# EAGLE schematic Pro Trinket Keyboard (EAGLE 7.1.0)
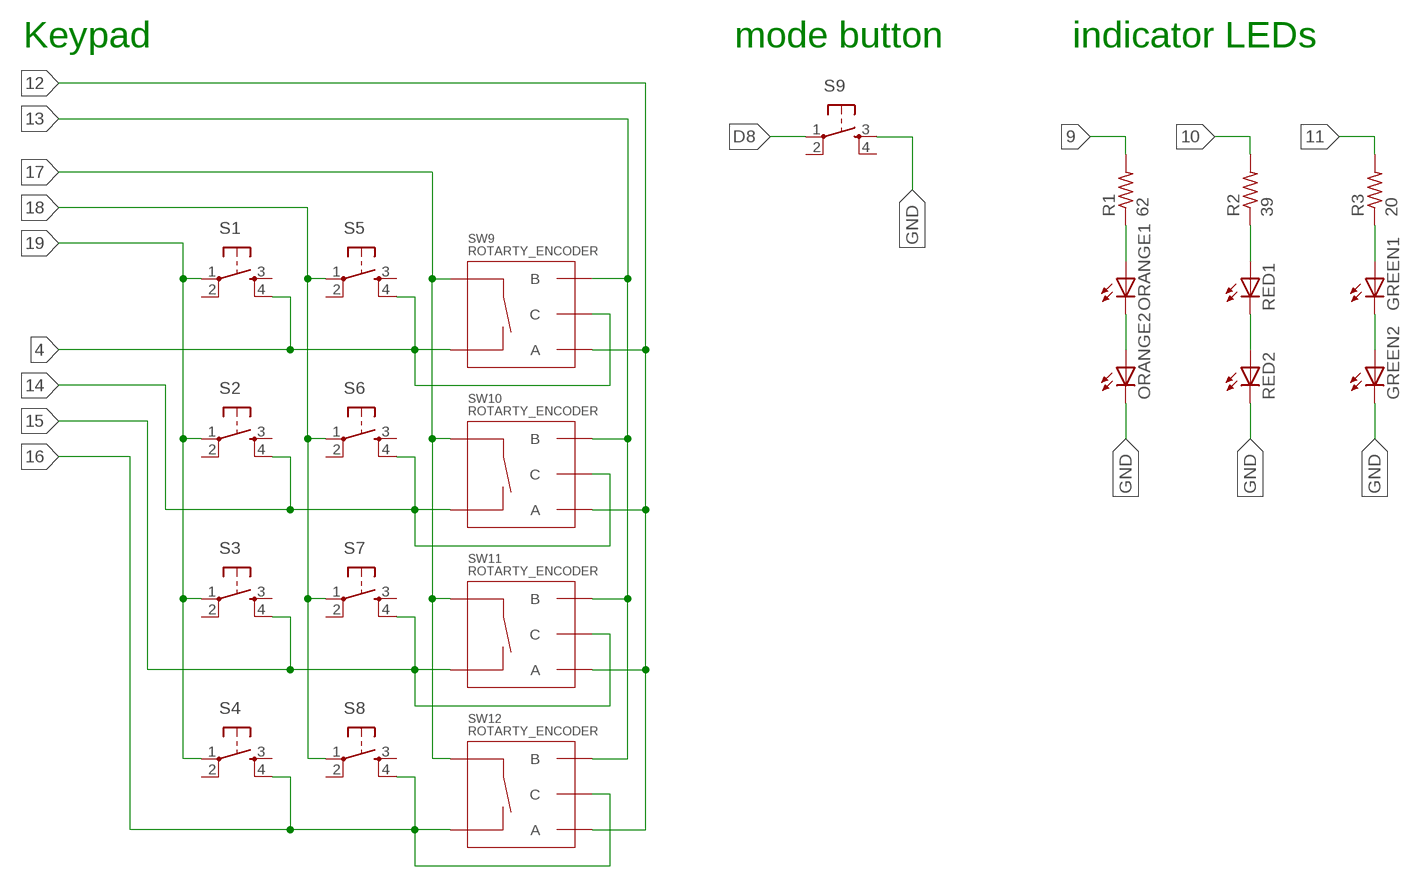
[diagram p0: schematic, sheet 1]

## Parts
GREEN1  LED3MM  [LED3MM]
GREEN2  LED3MM  [LED3MM]
ORANGE1  LED3MM  [LED3MM]
ORANGE2  LED3MM  [LED3MM]
R1  62  R-US_0204/7  [0204/7]
R2  39  R-US_0204/7  [0204/7]
R3  20  R-US_0204/7  [0204/7]
RED1  LED3MM  [LED3MM]
RED2  LED3MM  [LED3MM]
S1  TAC_SWITCHPTH  [TACTILE-PTH]
S2  TAC_SWITCHPTH  [TACTILE-PTH]
S3  TAC_SWITCHPTH  [TACTILE-PTH]
S4  TAC_SWITCHPTH  [TACTILE-PTH]
S5  TAC_SWITCHPTH  [TACTILE-PTH]
S6  TAC_SWITCHPTH  [TACTILE-PTH]
S7  TAC_SWITCHPTH  [TACTILE-PTH]
S8  TAC_SWITCHPTH  [TACTILE-PTH]
S9  TAC_SWITCHPTH  [TACTILE-PTH]
SW9  ROTARTY_ENCODER  [ROTARY_ENC_PLAIN]
SW10  ROTARTY_ENCODER  [ROTARY_ENC_PLAIN]
SW11  ROTARTY_ENCODER  [ROTARY_ENC_PLAIN]
SW12  ROTARTY_ENCODER  [ROTARY_ENC_PLAIN]

## Nets
4: S1.4 S5.4 SW9.C SW9.SW-
9: R1.2
10: R2.2
11: R3.2
12: SW9.A SW10.A SW11.A SW12.A
13: SW9.B SW10.B SW11.B SW12.B
14: S2.4 S6.4 SW10.C SW10.SW-
15: S3.4 S7.4 SW11.C SW11.SW-
16: S4.4 S8.4 SW12.C SW12.SW-
17: SW9.SW+ SW10.SW+ SW11.SW+ SW12.SW+
18: S5.1 S6.1 S7.1 S8.1
19: S1.1 S2.1 S3.1 S4.1
D8: S9.1
GND: GREEN2.K(C) ORANGE2.K(C) RED2.K(C) S9.3
N$1: ORANGE1.A R1.1
N$2: ORANGE1.K(C) ORANGE2.A
N$3: R2.1 RED1.A
N$4: RED1.K(C) RED2.A
N$5: GREEN1.A R3.1
N$6: GREEN1.K(C) GREEN2.A
Unconnected: S1.2 S1.3 S2.2 S2.3 S3.2 S3.3 S4.2 S4.3 S5.2 S5.3 S6.2 S6.3 S7.2 S7.3 S8.2 S8.3 S9.2 S9.4

## Notes on the sheet
- Keypad | mode button | indicator LEDs

## Library data of the parts
GREEN1 GREEN2 ORANGE1 ORANGE2 RED1 RED2 = adafruit:LED: LED OSRAM: - CHIPLED LG R971, LG N971, LY N971, LG Q971, LY Q971, LO R971, LY R971 LH N974, LH R974 LS Q976, LO Q976, LY Q976 LO Q996 - Hyper CHIPLED LW Q18S LB Q993, LB Q99A, LB R99A - SideLED LS A670, LO A670, LY A670, LG A670, LP A670 LB A673, LV A673, LT A673, LW A673 LH A674 LY A675 LS A676, LA A676, LO A676, LY A676, LW A676 LS A679, LY A679, LG A679 - Hyper Micro SIDELED® LS Y876, LA Y876, LO Y876, LY Y876 LT Y87S - SmartLED LW L88C, LW L88S LB L89C, LB L89S, LG L890 LS L89K, LO L89K, LY L89K LS L896, LA L896, LO L896, LY L896 - TOPLED LS T670, LO T670, LY T670, LG T670, LP T670 LSG T670, LSP T670, LSY T670, LOP T670, LYG T670 LG T671, LOG T671, LSG T671 LB T673, LV T673, LT T673, LW T673 LH T674 LS T676, LA T676, LO T676, LY T676, LB T676, LH T676, LSB T676, LW T676 LB T67C, LV T67C, LT T67C, LS T67K, LO T67K, LY T67K, LW E67C LS E67B, LA E67B, LO E67B, LY E67B, LB E67C, LV E67C, LT E67C LW T67C LS T679, LY T679, LG T679 LS T770, LO T770, LY T770, LG T770, LP T770 LB T773, LV T773, LT T773, LW T773 LH T774 LS E675, LA E675, LY E675, LS T675 LS T776, LA T776, LO T776, LY T776, LB T776 LHGB T686 LT T68C, LB T68C - Hyper Mini TOPLED® LB M676 - Mini TOPLED Santana® LG M470 LS M47K, LO M47K, LY M47K Source: http://www.osram.convergy.de/
R1-R3 = adafruit:R-US_: RESISTOR, American symbol
S1-S9 = SparkFun-Electromechanical:TAC_SWITCH: Momentary Switch Button commonly used for reset or general input. Spark Fun Electronics SKU : COM-00097 SMT- SWCH-08247
SW9-SW12 = SparkFun-Electromechanical:ROTARTY_ENCODER: Simple no LED rotary encoder Example: COM-09117